# Altium schematic sheet 2_DC_DC_Power.schdoc
size 297 x 209 mm; Symbol: sucaimuban; Company: 嘉立创EDA; Version: V1.0; Page Size: A4; @Project Name: 26gsSucaiku; @Update Date: 2026-06-26; @Create Date: 2026-06-21; Device: sucaimuban; @Board Name: Sucaiku; @Page Name: DC/DC_Power; @Create Time: 21:33:29; @Page Count: 6; @Page No: 2; @Schematic Name: Schematic1; @Update Time: 14:44:05; @Assembly Variant: Basic; Border: 1; Title Block Position: 3; Size: A4; Width: 1170; Height: 825; Region Start: 1; X Region Count: 6; Y Region Count: 4; Blade Width: 10
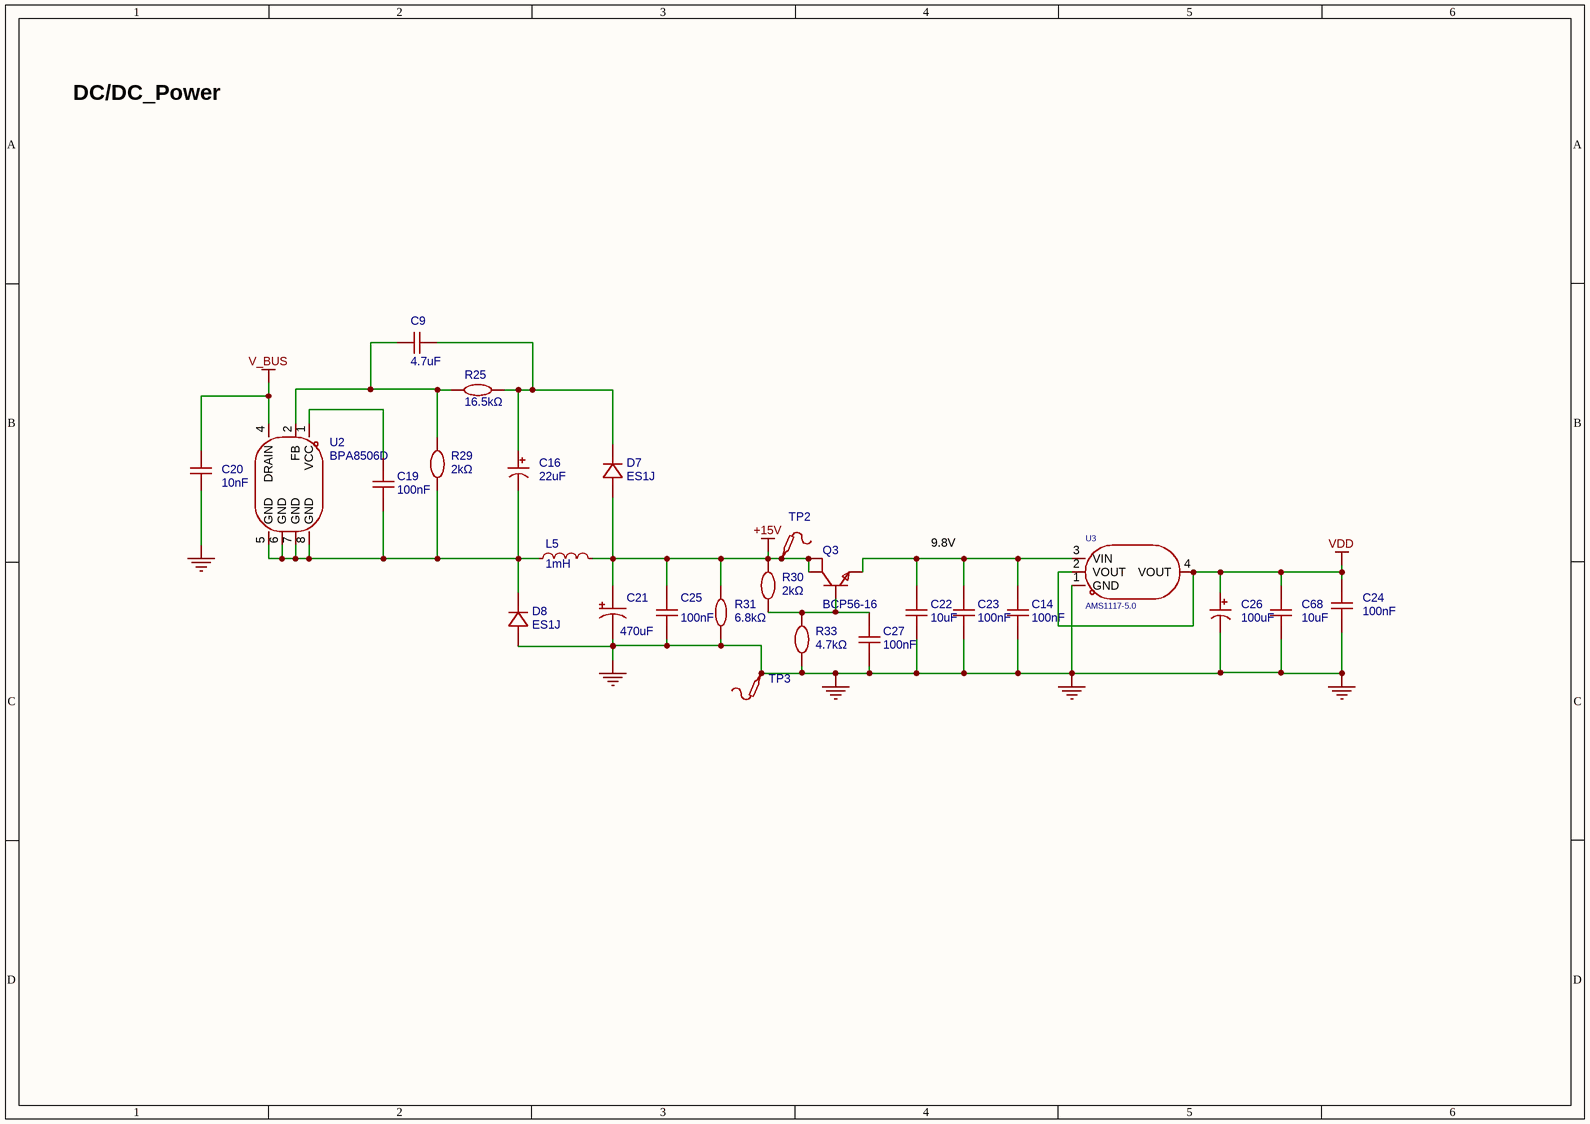
[diagram p0: 2_DC_DC_Power.schdoc]

## Parts
C9  4.7uF  [C0805]
C14  100nF  [C0603]
C16  22uF  [CAP-TH_BD5.0-P2.00-D0.8-FD]
C19  100nF  [C0603]
C20  10nF  [C1206]
C21  470uF  [CAP-TH_BD8.0-P3.50-D0.6-FD]
C22  10uF  [C1206]
C23  100nF  [C0603]
C24  100nF  [C0603]
C25  100nF  [C0603]
C26  100uF  [CAP-TH_BD5.0-P2.00-D0.8-FD]
C27  100nF  [C0603]
C68  10uF  [C1206]
D7  ES1J  [SMA_L4.3-W2.6-LS5.0-RD]
D8  ES1J  [SMA_L4.3-W2.6-LS5.0-RD]
L5  1mH  [IND-SMD_L8.0-W8.0_FNR80XXS]
Q3  BCP56-16  [SOT-223-4_L6.5-W3.5-P2.30-LS7.0-BR]
R25  16.5kΩ  [R0805]
R29  2kΩ  [R0805]
R30  2kΩ  [R1206]
R31  6.8kΩ  [R1206]
R33  4.7kΩ  [R1206]
TP2  (no value)  [Test-Point-0.5mm]
TP3  (no value)  [Test-Point-0.5mm]
U2  BPA8506D  [SOP-7_L4.9-W3.9-P1.27-LS6.0-BR]
U3  AMS1117-5.0  [SOT-223_L6.5-W3.5-P2.30-LS7.0-BR]

## Nets
+15V: C21.1 C25.1 D7.2(A) L5.2 Q3.2(C) Q3.4(C) R30.2 R31.2 TP2.1
GND: C14.2 C20.1 C21.2 C22.1 C23.2 C24.2 C25.2 C26.2 C27.2 C68.1 D8.2(A) R31.1 R33.1 TP3.1 U3.1(GND)
V_BUS: C20.2 U2.4(DRAIN)
VDD: C24.1 C26.1 C68.2 U3.2(VOUT) U3.4(VOUT)
NetC9_1: C9.1 C16.1 D7.1(K) R25.2
NetC9_2: C9.2 R25.1 R29.2 U2.2(FB)
NetC14_1: C14.1 C22.2 C23.1 Q3.3(E) U3.3(VIN)
NetC16_2: C16.2 C19.2 D8.1(K) L5.1 R29.1 U2.5(GND) U2.6(GND) U2.7(GND) U2.8(GND)
NetC19_1: C19.1 U2.1(VCC)
NetC27_1: C27.1 Q3.1(B) R30.1 R33.2

## Notes on the sheet
- DC/DC_Power
- 9.8V
- 身份证号
- 选手姓名
- 手 机 号
- 图页名称
- 第                      幅
- 工程名称
- 共                    幅
- 当前日期
- 当前时间

## Library data of the parts
C9 = CL21A475KAQNNNE: 容值:4.7uF;精度:±10%;额定电压:25V;温度系数:X5R;; Manufacturer: SAMSUNG(三星); AddInBom: yes; ModelId: 1ba041120af144c991958decab20d241聨0819f05c4eef4c71ace90d822a990e87; ModelName: C0805_L2.0-W1.3-H1.3; ModelTransform: 78.74,51.181,0,0,0,0,0,0.0005,0; Tolerance: ±10%; Voltage Rating: 25V; Temperature Coefficient: X5R; Symbol: CL21A475KAQNNNE; Device: CL21A475KAQNNNE; LCSC Part Name: 4.7uF ±10% 25V; SupplierPart: C1779; ManufacturerPart: CL21A475KAQNNNE; Supplier Footprint: 0805; JLCPCB Part Class: Basic Part; Datasheet: https://item.szlcsc.com/datasheet/CL21A475KAQNNNE/2131.html; Supplier: LCSC; ConvertToPcb: yes; FootprintName: C0805; Value: 4.7uF
C14 C19 C23-C25 C27 = CL10B104KB8NNNC: 容值:100nF;精度:±10%;额定电压:50V;温度系数:X7R;; Manufacturer: SAMSUNG(三星); AddInBom: yes; ModelId: ac125912035d415993ca9572d50418b1聨0819f05c4eef4c71ace90d822a990e87; ModelName: C0603_L1.6-W0.8-H0.8; ModelTransform: 62.992,31.496,0,0,0,0,0,0,0; Tolerance: ±10%; Voltage Rating: 50V; Temperature Coefficient: X7R; Symbol: CL10B104KB8NNNC; Device: CL10B104KB8NNNC; LCSC Part Name: 100nF ±10% 50V; SupplierPart: C1591; ManufacturerPart: CL10B104KB8NNNC; Supplier Footprint: 0603; JLCPCB Part Class: Extended Part; Datasheet: https://item.szlcsc.com/datasheet/CL10B104KB8NNNC/1943.html; Supplier: LCSC; ConvertToPcb: yes; FootprintName: C0603; Value: 100nF
C16 = 50YXF22MEFC5X11: 容值:22uF;精度:±20%;额定电压:50V;; Manufacturer: Rubycon(红宝石); AddInBom: yes; ModelId: edeeed87cbc746108d01291548c38636聨0819f05c4eef4c71ace90d822a990e87; ModelName: CAP-TH_D5.0×H7.0×P2.0; ModelTransform: 197.091,196.7911,0,0,0,0,0,0,-137.795; Tolerance: ±20%; Voltage Rating: 50V; Pin Spacing: 2mm; Lifetime: 5000hrs@105℃; Symbol: 50YXF22MEFC5X11; Device: 50YXF22MEFC5X11; LCSC Part Name: 22uF ±20% 50V; SupplierPart: C88755; ManufacturerPart: 50YXF22MEFC5X11; Supplier Footprint: 插件,D5xL11mm; JLCPCB Part Class: Extended Part; Datasheet: https://item.szlcsc.com/datasheet/50YXF22MEFC5X11/89935.html; Supplier: LCSC; ConvertToPcb: yes; FootprintName: CAP-TH_BD5.0-P2.00-D0.8-FD; Value: 22uF; Diameter: 5mm; Height - Seated (Max): 11mm; Operating Temperature: -40℃~+105℃
C20 = CC1206KKX7RCBB103: 容值:10nF;精度:±10%;额定电压:1kV;材质(温度系数):X7R;; Manufacturer: YAGEO(国巨); AddInBom: yes; ModelId: e4be705b945545a48e666415e3682bd8聨0819f05c4eef4c71ace90d822a990e87; ModelName: C1206_L3.2-W1.6-H1.3; ModelTransform: 125.984,62.992,0,0,0,0,0,0,0; Tolerance: ±10%; Voltage Rated: 1kV; Temperature Coefficient: X7R; Symbol: CC1206KKX7RCBB103; Device: CC1206KKX7RCBB103; LCSC Part Name: 10nF ±10% 1kV; SupplierPart: C107192; ManufacturerPart: CC1206KKX7RCBB103; Supplier Footprint: 1206; JLCPCB Part Class: Extended Part; Datasheet: https://atta.szlcsc.com/upload/public/pdf/source/20180910/C282080_BCE296114B59C3710FB69343383A5C6E.pdf; Supplier: LCSC; ConvertToPcb: yes; FootprintName: C1206; Value: 10nF
C21 = GR1E471MF140A00CV016: 容值:470uF;精度:±20%;额定电压:25V;; Manufacturer: HUAWEI(华威集团); AddInBom: yes; ModelId: a2c936ec27754f809f3966430e36f767聨0819f05c4eef4c71ace90d822a990e87; ModelName: CAP-TH_D8.0-H8.0-P3.50; ModelTransform: 314.96,314.862,0,180,0,0,0,0,-137.795; Tolerance: ±20%; Voltage Rating: 25V; Pin Spacing: 3.5mm; Lifetime: 2000hrs@85℃; Symbol: GR1E471MF140A00CV016; Device: GR1E471MF140A00CV016; LCSC Part Name: 470uF ±20% 25V; SupplierPart: C271374; ManufacturerPart: GR1E471MF140A00CV016; Supplier Footprint: 插件,D8xL14mm; JLCPCB Part Class: Extended Part; Datasheet: https://item.szlcsc.com/datasheet/GR1E471MF140A00CV016/260517.html; Supplier: LCSC; ConvertToPcb: yes; FootprintName: CAP-TH_BD8.0-P3.50-D0.6-FD; Value: 470uF; Diameter: 8mm; Height - Seated (Max): 14mm
C22 C68 = HGC1206R5106K500NSPJ: 容值:10uF;精度:±10%;额定电压:50V;温度系数:X5R;; Manufacturer: Chinocera(华瓷); AddInBom: yes; ModelId: e4be705b945545a48e666415e3682bd8聨0819f05c4eef4c71ace90d822a990e87; ModelName: C1206_L3.2-W1.6-H1.3; ModelTransform: 125.984,62.992,0,0,0,0,0,0,0; Tolerance: ±10%; Voltage Rating: 50V; Temperature Coefficient: X5R; Symbol: HGC1206R5106K500NSPJ; Device: HGC1206R5106K500NSPJ; LCSC Part Name: 10uF ±10% 50V; SupplierPart: C7432781; ManufacturerPart: HGC1206R5106K500NSPJ; Supplier Footprint: 1206; JLCPCB Part Class: Extended Part; Datasheet: https://item.szlcsc.com/datasheet/HGC1206R5106K500NSPJ/8438263.html; Supplier: LCSC; ConvertToPcb: yes; FootprintName: C1206; Value: 10uF
C26 = 16PX100MEFC5X11: 容值:100uF;精度:±20%;额定电压:16V;纹波电流:130mA@120Hz;等效串联电阻:-;; Manufacturer: rubycon(红宝石); AddInBom: yes; ModelId: edeeed87cbc746108d01291548c38636聨0819f05c4eef4c71ace90d822a990e87; ModelName: CAP-TH_D5.0×H7.0×P2.0; ModelTransform: 197.091,196.7911,0,0,0,0,0,0,-137.795; Tolerance: ±20%; Rated Voltage: 16V; φD: 5mm; L: 11mm; Lifetime @ Temp: 1000hrs@105℃; Symbol: 16PX100MEFC5X11; Device: 16PX100MEFC5X11; LCSC Part Name: 100uF ±20% 16V; SupplierPart: C88753; ManufacturerPart: 16PX100MEFC5X11; Supplier Footprint: 插件,D5xL11mm; JLCPCB Part Class: Extended Part; Datasheet: https://atta.szlcsc.com/upload/public/pdf/source/20171026/C136025_15089841766351059112.pdf; Supplier: LCSC; ConvertToPcb: yes; FootprintName: CAP-TH_BD5.0-P2.00-D0.8-FD; Value: 100uF; Ripple Current: 130mA@120Hz; Equivalent Series Resistance(ESR): -; Lead Spacing: 2mm; Operating Temperature: -25℃~+105℃
D7 D8 = ES1J_C18199159: 二极管配置:1个独立式;正向压降(Vf):1.7V@1A;直流反向耐压(Vr):600V;整流电流:1A;反向恢复时间(Trr):35ns;; Manufacturer: R+O(宏嘉诚); AddInBom: yes; ModelId: 8d2dd2e50a3a4b27821fa63d469a8f11聨0819f05c4eef4c71ace90d822a990e87; ModelTransform: 196.85,102.362,0,0,0,0,0,0,0; Diode Configuration: 1个独立式; Voltage - DC Reverse(Vr): 600V; Current - Rectified: 1A; Reverse Leakage Current (Ir): 2uA@600V; Reverse Recovery Time (trr): 35ns; Operating Junction Temperature Range: -55℃~+150℃; Non-Repetitive Peak Forward Surge Current: 30A; Symbol: ES1J; Device: ES1J_C18199159; LCSC Part Name: 耐压:600V 电流:1A 反向恢复时间：35ns; SupplierPart: C18199159; ManufacturerPart: ES1J; Supplier Footprint: SMA(DO-214AC); JLCPCB Part Class: Extended Part; Datasheet: https://item.szlcsc.com/datasheet/ES1J/19354391.html; Supplier: LCSC; ConvertToPcb: yes; FootprintName: SMA_L4.3-W2.6-LS5.0-RD; ModelName: SMA_L4.3-W2.6-LS5.0-RD; Voltage - Forward(Vf@If): 1.7V@1A; Pd - Power Dissipation: -
L5 = FNR8040S102MT: 电感值:1mH;精度:±20%;额定电流:400mA;饱和电流(Isat):500mA;类型:磁胶屏蔽绕线合金电感;; Manufacturer: cjiang(长江微电); AddInBom: yes; ModelId: d5ac0014766247b8a9453b0228ebb8be聨0819f05c4eef4c71ace90d822a990e87; ModelName: IND-SMD_L8.0-W8.0-H6.5_FNR80XXS; ModelTransform: 314.96,314.96,0,270,0,0,0,0,0; Tolerance: ±20%; Current Rating: 400mA; Current - Saturation(Isat): 500mA; DC Resistance(DCR): 3.64Ω; Symbol: FNR8040S102MT; Device: FNR8040S102MT; LCSC Part Name: 1mH ±20% 500mA; SupplierPart: C168152; ManufacturerPart: FNR8040S102MT; Supplier Footprint: SMD,8x8mm; JLCPCB Part Class: Extended Part; Datasheet: https://atta.szlcsc.com/upload/public/pdf/source/20190327/C167925_9EFF0AABC4CA629C2CC95961DBF7D39D.pdf; Supplier: LCSC; ConvertToPcb: yes; FootprintName: IND-SMD_L8.0-W8.0_FNR80XXS; Value: 1mH; Type: 磁胶屏蔽绕线合金电感
Q3 = BCP56-16_C41375109: 晶体管类型:NPN;集电极电流(Ic):1A;集射极击穿电压(Vceo):80V;耗散功率(Pd):1.33W;直流电流增益(hFE):25@5mA,2V;; Manufacturer: R+O(宏嘉诚); AddInBom: yes; ModelId: 925194bf9823436183a3e0b978a8d076聨0819f05c4eef4c71ace90d822a990e87; ModelName: SOT-223-4P_L6.5-W3.5-H1.6-LS7.0-P2.30; ModelTransform: 279.89794,255.905,0,180,0,0,-0.0005,-0.0005,0; type: NPN; Current - Collector(Ic): 1A; Collector - Emitter Voltage VCEO: 80V; Pd - Power Dissipation: 1.33W; Transition frequency(fT): 130MHz; Current - Collector Cutoff: 100nA; Vce Saturation(VCE(sat)): 500mV@500mA,50mA; Emitter-Base Voltage(Vebo): 5V; Symbol: BCP56-16_C41375109; Device: BCP56-16_C41375109; LCSC Part Name: NPN 电流:1A 电压:80V; SupplierPart: C41375109; ManufacturerPart: BCP56-16; Supplier Footprint: SOT-223; JLCPCB Part Class: Extended Part; Datasheet: https://item.szlcsc.com/datasheet/BCP56-16/43142109.html; Supplier: LCSC; ConvertToPcb: yes; FootprintName: SOT-223-4_L6.5-W3.5-P2.30-LS7.0-BR; DC Current Gain: 25@5mA,2V; Operating Temperature: -
R25 = 0805W8F1652T5E: 电阻类型:厚膜电阻;阻值:16.5kΩ;精度:±1%;功率:125mW;工作电压:150V;温度系数:±100ppm/℃;; Manufacturer: UNI-ROYAL(厚声); AddInBom: yes; ModelId: 37a81e68749a4138bd2dfa6897b24b85聨0819f05c4eef4c71ace90d822a990e87; ModelName: R0805_L2.0-W1.3-H0.6; ModelTransform: 78.74,51.181,0,0,0,0,0,-0.0005,0; Tolerance: ±1%; Power(Watts): 125mW; Voltage-Supply(Max): 150V; Symbol: 0805W8F1652T5E; Device: 0805W8F1652T5E; LCSC Part Name: 16.5kΩ ±1% 125mW 厚膜电阻; SupplierPart: C35929; ManufacturerPart: 0805W8F1652T5E; Supplier Footprint: 0805; JLCPCB Part Class: Extended Part; Datasheet: https://item.szlcsc.com/datasheet/0805W8F1652T5E/36906.html; Supplier: LCSC; ConvertToPcb: yes; FootprintName: R0805; Type: 厚膜电阻; Value: 16.5kΩ; Temperature Coefficient: ±100ppm/℃; Operating Temperature: -55℃~+155℃
R29 = FRC0805F2001TS: 电阻类型:厚膜电阻;阻值:2kΩ;精度:±1%;功率:125mW;工作电压:150V;温度系数:±100ppm/℃;; Manufacturer: FOJAN(富捷); AddInBom: yes; ModelId: 37a81e68749a4138bd2dfa6897b24b85聨0819f05c4eef4c71ace90d822a990e87; ModelName: R0805_L2.0-W1.3-H0.6; ModelTransform: 78.74,51.181,0,0,0,0,0,-0.0005,0; Tolerance: ±1%; Power(Watts): 125mW; Voltage-Supply(Max): 150V; Symbol: FRC0805F2001TS; Device: FRC0805F2001TS; LCSC Part Name: 2kΩ ±1% 125mW 厚膜电阻; SupplierPart: C2907248; ManufacturerPart: FRC0805F2001TS; Supplier Footprint: 0805; JLCPCB Part Class: Extended Part; Supplier: LCSC; ConvertToPcb: yes; FootprintName: R0805; Type: 厚膜电阻; Value: 2kΩ; Temperature Coefficient: ±100ppm/℃; Operating Temperature: -55℃~+155℃
R30 = GR1206F2KT5G00: 电阻类型:厚膜电阻;阻值:2kΩ;精度:±1%;功率:250mW;工作电压:200V;; Manufacturer: GiantOhm(鼎声微电); AddInBom: yes; ModelId: 89a1f13db2384da588040e0b3c55bf66聨0819f05c4eef4c71ace90d822a990e87; ModelName: R1206_L3.2-W1.6-H0.6; ModelTransform: 125.984,62.992,0,0,0,0,0,0,0; Tolerance: ±1%; Power(Watts): 250mW; Voltage-Supply(Max): 200V; Symbol: GR1206F2KT5G00; Device: GR1206F2KT5G00; LCSC Part Name: 2K ±1%; SupplierPart: C49656411; ManufacturerPart: GR1206F2KT5G00; Supplier Footprint: 1206; JLCPCB Part Class: Extended Part; Datasheet: https://item.szlcsc.com/datasheet/GR1206F2KT5G00/52214001.html; Supplier: LCSC; ConvertToPcb: yes; FootprintName: R1206; Type: 厚膜电阻; Value: 2kΩ; Operating Temperature: -55℃~+155℃
R31 = 1206W4F6801T5E: 电阻类型:厚膜电阻;阻值:6.8kΩ;精度:±1%;功率:250mW;工作电压:200V;温度系数:±100ppm/℃;; Manufacturer: UNI-ROYAL(厚声); AddInBom: yes; ModelId: 89a1f13db2384da588040e0b3c55bf66聨0819f05c4eef4c71ace90d822a990e87; ModelName: R1206_L3.2-W1.6-H0.6; ModelTransform: 125.984,62.992,0,0,0,0,0,0,0; Tolerance: ±1%; Power(Watts): 250mW; Voltage-Supply(Max): 200V; Symbol: 1206W4F6801T5E; Device: 1206W4F6801T5E; LCSC Part Name: 6.8kΩ ±1% 250mW 厚膜电阻; SupplierPart: C26034; ManufacturerPart: 1206W4F6801T5E; Supplier Footprint: 1206; JLCPCB Part Class: Extended Part; Datasheet: https://item.szlcsc.com/datasheet/1206W4F6801T5E/26777.html; Supplier: LCSC; ConvertToPcb: yes; FootprintName: R1206; Type: 厚膜电阻; Value: 6.8kΩ; Temperature Coefficient: ±100ppm/℃; Operating Temperature: -55℃~+155℃
R33 = FRP1206F4701TS: 电阻类型:厚膜电阻;阻值:4.7kΩ;精度:±1%;功率:500mW;工作电压:200V;温度系数:±100ppm/℃;; Manufacturer: FOJAN(富捷); AddInBom: yes; ModelId: 89a1f13db2384da588040e0b3c55bf66聨0819f05c4eef4c71ace90d822a990e87; ModelName: R1206_L3.2-W1.6-H0.6; ModelTransform: 125.984,62.992,0,0,0,0,0,0,0; Tolerance: ±1%; Power(Watts): 500mW; Voltage-Supply(Max): 200V; Symbol: FRP1206F4701TS; Device: FRP1206F4701TS; LCSC Part Name: 厚膜电阻 1206 4.7KΩ ±1% 500mW; SupplierPart: C54102245; ManufacturerPart: FRP1206F4701TS; Supplier Footprint: 1206; JLCPCB Part Class: Extended Part; Datasheet: https://item.szlcsc.com/datasheet/FRP1206F4701TS/57319625.html; Supplier: LCSC; ConvertToPcb: yes; FootprintName: R1206; Type: 厚膜电阻; Value: 4.7kΩ; Temperature Coefficient: ±100ppm/℃; Operating Temperature: -55℃~+155℃
TP2 TP3 = Test-Point: Test Point 测试点; AddInBom: yes; Symbol: Test-Point; Device: Test-Point; ConvertToPcb: yes; FootprintName: Test-Point-0.5mm
U2 = BPA8506D: 电压:连续可调/400mA 工业级辅助电源芯片; Manufacturer: BPS(上海晶丰明源); AddInBom: yes; ModelId: 4c4ce7185fd740e384edc3256ac39212聨0819f05c4eef4c71ace90d822a990e87; ModelTransform: 236.22,192.913,0,0,0,0,0,0,0; Output Isolation: 非隔离; Topology: 降压式; Symbol: BPA8506D; Device: BPA8506D; LCSC Part Name: AC-DC电源芯片; SupplierPart: C5119885; ManufacturerPart: BPA8506D; Supplier Footprint: SOP-7; JLCPCB Part Class: Extended Part; Datasheet: https://atta.szlcsc.com/upload/public/pdf/source/20220808/6F529D685BCC89C565740F166C056501.pdf; Supplier: LCSC; ConvertToPcb: yes; FootprintName: SOP-7_L4.9-W3.9-P1.27-LS6.0-BR; ModelName: SOP-7_L4.9-W3.9-P1.27-LS6.0-BR
U3 = AMS1117-5.0_C6187: 输出极性:正极;工作电压:15V;输出电压:5V;输出电流:1A;电源纹波抑制比(PSRR):60dB;输出类型:固定;; Manufacturer: Advanced Monolithic Systems; AddInBom: yes; ModelId: 925194bf9823436183a3e0b978a8d076聨0819f05c4eef4c71ace90d822a990e87; ModelName: SOT-223-4P_L6.5-W3.5-H1.6-LS7.0-P2.30; ModelTransform: 279.89794,255.905,0,180,0,0,0.0005,0.0005,0; Output Configuration: 正极; Voltage - Supply: 15V; Output Voltage: 5V; Output Current: 1A; Power Supply Rejection Ratio (PSRR): 60dB; Voltage Dropout: 1.3V; standby current: 5mA; Noise: 0.003%Vout; Output Type: 固定; Number of Outputs: 1; Symbol: AMS1117-5.0; Device: AMS1117-5.0_C6187; LCSC Part Name: 5V 1A 15V; SupplierPart: C6187; ManufacturerPart: AMS1117-5.0; Supplier Footprint: SOT-223; JLCPCB Part Class: Basic Part; Datasheet: https://item.szlcsc.com/datasheet/AMS1117-5.0/6653.html; Supplier: LCSC; ConvertToPcb: yes; FootprintName: SOT-223_L6.5-W3.5-P2.30-LS7.0-BR; Features: 短路保护；热关断; Operating Temperature: -40℃~+125℃